# Altium schematic sheet NCS_Wireless_Indicator_mcu1.SchDoc
size A
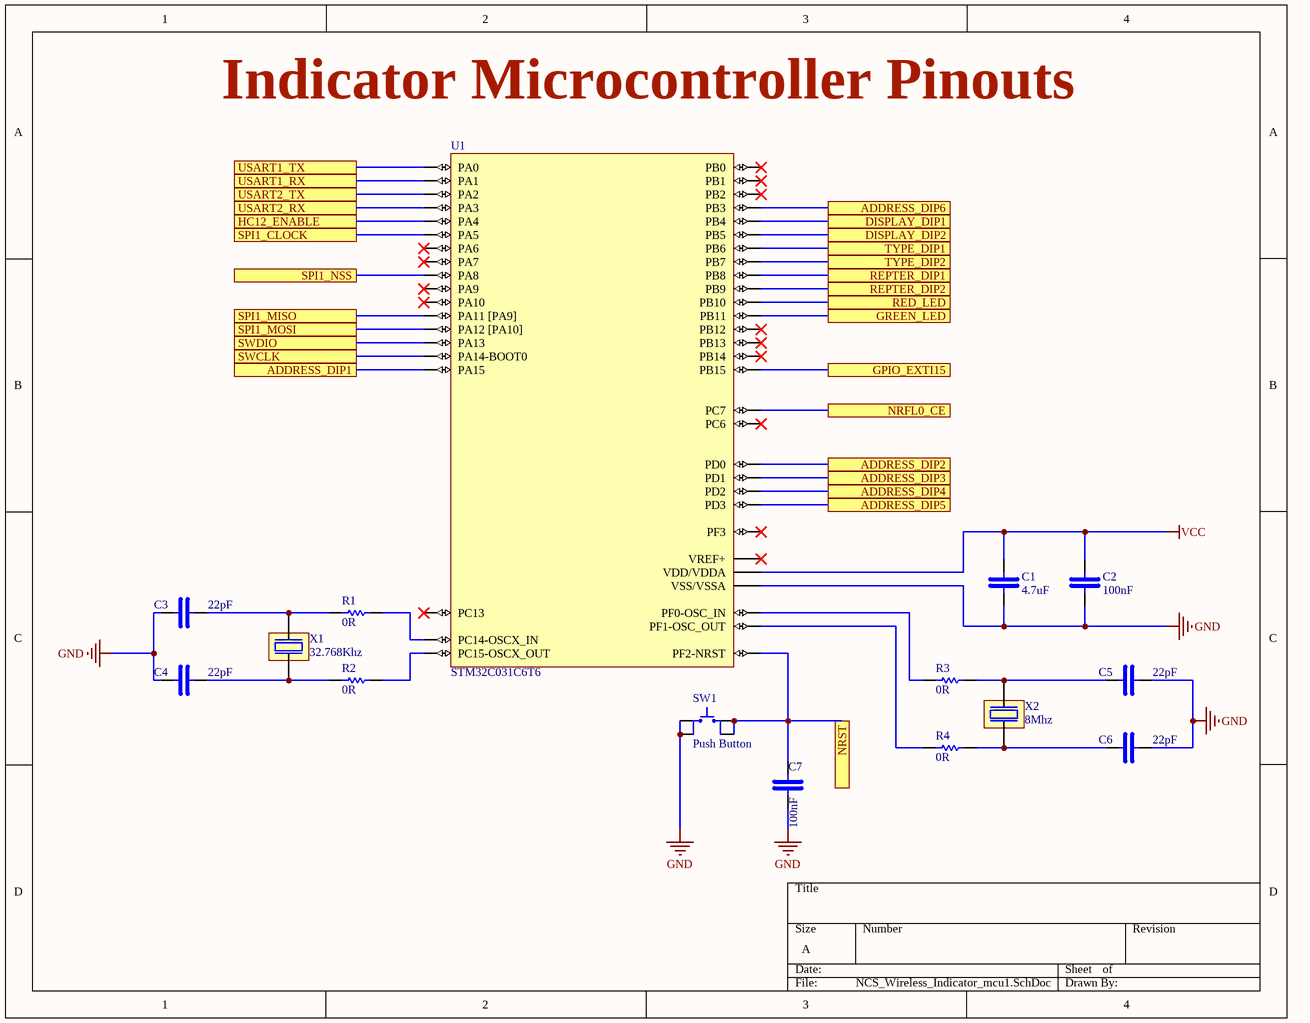
[diagram p0: NCS_Wireless_Indicator_mcu1.SchDoc]

## Parts
C1  4.7uF  [C0805C209D3HACTU_2pF]
C2  100nF  [C0805C104K3RACTU_100nF]
C3  22pF  [C0805C209D3HACTU_2pF]
C4  22pF  [C0805C209D3HACTU_2pF]
C5  22pF  [C0805C209D3HACTU_2pF]
C6  22pF  [C0805C209D3HACTU_2pF]
C7  100nF  [C0805C104K3RACTU_100nF]
R1  0R  [RC0805JR-070RL]
R2  0R  [RC0805JR-070RL]
R3  0R  [RC0805JR-070RL]
R4  0R  [RC0805JR-070RL]
SW1  Push Button  [PUSH BUTTON SMD]
U1  STM32C031C6T6  [STM32C031C6T6-48N]
X1  32.768Khz  [32.768KHz]
X2  8Mhz  [8Mhz Crystal]

## Ports
ADDRESS_DIP1, ADDRESS_DIP2, ADDRESS_DIP3, ADDRESS_DIP4, ADDRESS_DIP5, ADDRESS_DIP6, DISPLAY_DIP1, DISPLAY_DIP2, GPIO_EXTI15, GREEN_LED, HC12_ENABLE, NRFL0_CE, NRST, RED_LED, REPTER_DIP1, REPTER_DIP2, SPI1_CLOCK, SPI1_MISO, SPI1_MOSI, SPI1_NSS, SWCLK, SWDIO, TYPE_DIP1, TYPE_DIP2, USART1_RX, USART1_TX, USART2_RX, USART2_TX

## Nets
GND: C1.1 C2.1 C3.2 C4.2 C5.1 C6.1 C7.1 SW1.1 SW1.2 U1.7(VSS/VSSA)
VCC: C1.2 C2.2 U1.6(VDD/VDDA)
ADDRESS_DIP1: U1.37(PA15) ; port ADDRESS_DIP1
ADDRESS_DIP2: U1.38(PD0) ; port ADDRESS_DIP2
ADDRESS_DIP3: U1.39(PD1) ; port ADDRESS_DIP3
ADDRESS_DIP4: U1.40(PD2) ; port ADDRESS_DIP4
ADDRESS_DIP5: U1.41(PD3) ; port ADDRESS_DIP5
ADDRESS_DIP6: U1.42(PB3) ; port ADDRESS_DIP6
DISPLAY_DIP1: U1.43(PB4) ; port DISPLAY_DIP1
DISPLAY_DIP2: U1.44(PB5) ; port DISPLAY_DIP2
GPIO_EXTI15: U1.27(PB15) ; port GPIO_EXTI15
GREEN_LED: U1.23(PB11) ; port GREEN_LED
HC12_ENABLE: U1.15(PA4) ; port HC12_ENABLE
NRFL0_CE: U1.31(PC7) ; port NRFL0_CE
NRST: C7.2 SW1.3 SW1.4 U1.10(PF2-NRST) ; port NRST
RED_LED: U1.22(PB10) ; port RED_LED
REPTER_DIP1: U1.47(PB8) ; port REPTER_DIP1
REPTER_DIP2: U1.48(PB9) ; port REPTER_DIP2
SPI1_CLOCK: U1.16(PA5) ; port SPI1_CLOCK
SPI1_MISO: U1.33(PA11_[PA9]) ; port SPI1_MISO
SPI1_MOSI: U1.34(PA12_[PA10]) ; port SPI1_MOSI
SPI1_NSS: U1.28(PA8) ; port SPI1_NSS
SWCLK: U1.36(PA14-BOOT0) ; port SWCLK
SWDIO: U1.35(PA13) ; port SWDIO
TYPE_DIP1: U1.45(PB6) ; port TYPE_DIP1
TYPE_DIP2: U1.46(PB7) ; port TYPE_DIP2
USART1_RX: U1.12(PA1) ; port USART1_RX
USART1_TX: U1.11(PA0) ; port USART1_TX
USART2_RX: U1.14(PA3) ; port USART2_RX
USART2_TX: U1.13(PA2) ; port USART2_TX
NetC3_1: C3.1 R1.1 X1.2
NetC4_1: C4.1 R2.1 X1.1
NetC5_2: C5.2 R3.2 X2.2
NetC6_2: C6.2 R4.2 X2.1
NetR1_2: R1.2 U1.2(PC14-OSCX_IN)
NetR2_2: R2.2 U1.3(PC15-OSCX_OUT)
NetR3_1: R3.1 U1.8(PF0-OSC_IN)
NetR4_1: R4.1 U1.9(PF1-OSC_OUT)

Not connected (* = marked no-connect by the designer): U1 1(PC13)* 4(PF3)* 5(VREF+)* 17(PA6)* 18(PA7)* 19(PB0)* 20(PB1)* 21(PB2)* 24(PB12)* 25(PB13)* 26(PB14)* 29(PA9)* 30(PC6)* 32(PA10)*

## Notes on the sheet
- Indicator Microcontroller Pinouts

## Library data of the parts
C1 = C0805C475K3PACTU: Multilayer Ceramic Capacitor, 4.7 uF, 25 V, ï¿½ 10%, X5R, 0805 [2012 Metric]; Manufacturer: KEMET; Material: 4241ConductorMaterial; Dissipation Factor: 5%; Voltage Rating (DC): 25V; Supplier: Mouser; Supplier Part Number: 80-C0805C475K3P; Manufacturer Part Number: C0805C475K3PACTU; RoHS: Yes; Category: Ceramic Capacitors; Stock: 222120; Pricing: 1=0.28, 10=0.131, 50=0.131, 100=0.086, 1000=0.071, 10000=0.045 (USD); Mounting Technology: Surface Mount,PCB; Case/Package: 0805; Pins: 2NUMBER; Case Code (Imperial): 0805; Case Code (Metric): 2012; Min Operating Temperature: -55°C; Max Operating Temperature: 85°C; Value: 4.7uF; Tolerance: 10%; Packaging: Tape and Reel; Dielectric: X5R; Termination: SMD/SMT; Package Quantity: 2500; Series: SMD Comm X5R; Construction: Flat; Length: 2mm; Width: 1.2mm; Height: 1.25mm; Depth: 1.25mm; Thickness: 1.397mm; Radiation Hardening: No; Reach SVHC Compliant: No; RoHS Compliant: Yes; ComponentLink1URL: https://datasheet.ciiva.com/22748/1918694-22748309.pdf?src-supplier=Element14; ComponentLink1Description: https://datasheet.ciiva.com/22748/1918694-22748309.pdf?src-supplier=Element14; ComponentLink2URL: https://datasheet.ciiva.com/18193/getdatasheetpartid-195812-18193898.pdf?src-supplier=Verical; ComponentLink2Description: https://datasheet.ciiva.com/18193/getdatasheetpartid-195812-18193898.pdf?src-supplier=Verical; ComponentLink3URL: https://datasheet.ciiva.com/18193/getdatasheetpartid-385757-18193895.pdf?src-supplier=Verical; ComponentLink3Description: https://datasheet.ciiva.com/18193/getdatasheetpartid-385757-18193895.pdf?src-supplier=Verical
C2 C7 = C0805C104K3RACTU: Multilayer Ceramic Capacitor, 0.1 uF, 25 V, ï¿½ 10%, X7R, 0805 [2012 Metric]; Manufacturer: KEMET; Material: 4241ConductorMaterial; Voltage Rating: 25V; Temperature Coefficient: 30ppm/°C; Supplier: Mouser; Supplier Part Number: 80-C0805C104K3R; Manufacturer Part Number: C0805C104K3RACTU; RoHS: Yes; Category: Ceramic Capacitors; Stock: 259681; Pricing: 1=0.1, 10=0.03, 50=0.03, 100=0.027, 1000=0.021, 10000=0.015 (USD); Mounting Technology: Surface Mount,PCB; Case/Package: 0805; Pins: 2NUMBER; Case Code (Imperial): 0805; Case Code (Metric): 2012; Min Operating Temperature: -55°C; Max Operating Temperature: 125°C; Packaging: Tape and Reel; Tolerance: 10%; Value: 100nF; Dielectric: X7R; Termination: SMD/SMT; Package Quantity: 4000; Series: SMD Comm X7R; Voltage Rating (DC): 25V; Construction: Flat; Length: 2mm; Width: 1.2mm; Height: 0.9mm; Depth: 1.25mm; Lead Pitch: 0.75mm; Thickness: 889um; Radiation Hardening: No; RoHS Compliant: Yes; Lead Free: 5697LeadFree; Reach SVHC Compliant: 4186SVHC; ComponentLink1URL: https://datasheet.ciiva.com/7842/kem-c1002-x7r-smd-7842536.pdf?src-supplier=Element14; ComponentLink1Description: https://datasheet.ciiva.com/7842/kem-c1002-x7r-smd-7842536.pdf?src-supplier=Element14; ComponentLink2URL: https://datasheet.ciiva.com/7842/kem-c1002-x7r-smd-7842538.pdf?src-supplier=Element14; ComponentLink2Description: https://datasheet.ciiva.com/7842/kem-c1002-x7r-smd-7842538.pdf?src-supplier=Element14
C3-C6 = C0805C209D3HACTU: C0805C209D3HACTU_2pF; Manufacturer: KEMET; Supplier: Mouser; Supplier Part Number: 80-C0805C209D3HACTU; Manufacturer Part Number: C0805C209D3HACTU; RoHS: Yes; Category: Capacitors; Stock: 22626; Pricing: 1=0.1, 10=0.032, 50=0.032, 100=0.02, 1000=0.015, 10000=0.01 (USD); RoHS Compliant: Yes
R1-R4 = RC0805JR-070RL: GENERAL PURPOSE CHIP RESISTOR Metal Glaze/thick Film, 0.125W, 0ohm, Surface Mount, 0805; Manufacturer: Yageo; Value: 0mR; Tolerance: 5%; Voltage Rating: 150V; Power Rating: 125mW; Temperature Coefficient: 200ppm/°C; Supplier: Future Electronics; Supplier Part Number: 2506467; Manufacturer Part Number: RC0805JR-070RL; RoHS: Yes; Category: Chip SMD Resistors; Stock: 435000; Pricing: 5000=0.0014, 25000=0.0013, 100000=0.0013, 125000=0.0013, 250000=0.0012, 500000=0.0012, 625000=0.0012, 1250000=0.0012 (USD); Case/Package: 0805; Pins: 2; Contact Plating: Tin,Matte; Case Code (Imperial): 0805; Case Code (Metric): 2012; Min Operating Temperature: -55°C; Max Operating Temperature: 155°C; Resistor Type: Thick Film; Packaging: Tape and Reel; Voltage Rating (DC): 150V; Termination: SMD/SMT; Features: Moisture Resistant; Series: RC; Max Power Dissipation: 125mW; Number of Terminations: 2; Construction: Rectangular; Technology: THICK FILM; Resistance Tolerance: 5%; Length: 2mm; Width: 1.25mm; Height: 0.5mm; Depth: 1.25mm; RoHS Compliant: Yes; Military Standard: Not; Reach SVHC Compliant: Unknown; Lead Free: 5697LeadFree; ComponentLink1URL: https://datasheet.ciiva.com/11819/0900766b8106beab-11819430.pdf?src-supplier=Rs; ComponentLink1Description: https://datasheet.ciiva.com/11819/0900766b8106beab-11819430.pdf?src-supplier=Rs; ComponentLink2URL: https://datasheet.ciiva.com/7941/1738694-7941861.pdf?src-supplier=Element14; ComponentLink2Description: https://datasheet.ciiva.com/7941/1738694-7941861.pdf?src-supplier=Element14; ComponentLink3URL: https://datasheet.ciiva.com/7941/1738694-7941862.pdf?src-supplier=Element14; ComponentLink3Description: https://datasheet.ciiva.com/7941/1738694-7941862.pdf?src-supplier=Element14; ComponentLink4URL: https://datasheet.ciiva.com/7941/1738694-7941863.pdf?src-supplier=Element14; ComponentLink4Description: https://datasheet.ciiva.com/7941/1738694-7941863.pdf?src-supplier=Element14; ComponentLink5URL: https://datasheet.ciiva.com/15190/getdatasheetpartid-330685-15190028.pdf?src-supplier=Verical; ComponentLink5Description: https://datasheet.ciiva.com/15190/getdatasheetpartid-330685-15190028.pdf?src-supplier=Verical
SW1 = Tactile Switch SMD 4P 5.2x5.2x1.5mm - EVELTA
U1 = STM32C031C6T6: RISC Microcontroller, 32-Bit, FLASH, CORTEX-M4F CPU, 180MHz, CMOS, PBGA216; Manufacturer: STMicroelectronics; Supplier 1: Mouser; Manufacturer Part Number: STM32C031C6T6; RoHS: No; Category: Microcontrollers; Stock 1: 900; Pricing 1: 1=2.39, 10=1.53, 50=1.36, 100=1.12, 1000=0.78, 10000=0.629 (USD); ComponentLink1URL: https://datasheet.octopart.com/STM32C031C6T6-STMicroelectronics-datasheet-168218616.pdf?src-supplier=TME; ComponentLink1Description: https://datasheet.octopart.com/STM32C031C6T6-STMicroelectronics-datasheet-168218616.pdf?src-supplier=TME; Supplier Part Number 1: 511-STM32C031C6T6
X1 = 32.768 Khz RTC Crystal T38-SUNROM
X2 = 8 Mhz Crystal HC-49US-SUNROM